# EAGLE design kiev_nrf2401_reva (EAGLE 6.6.0)

## Sheet 1 of 2
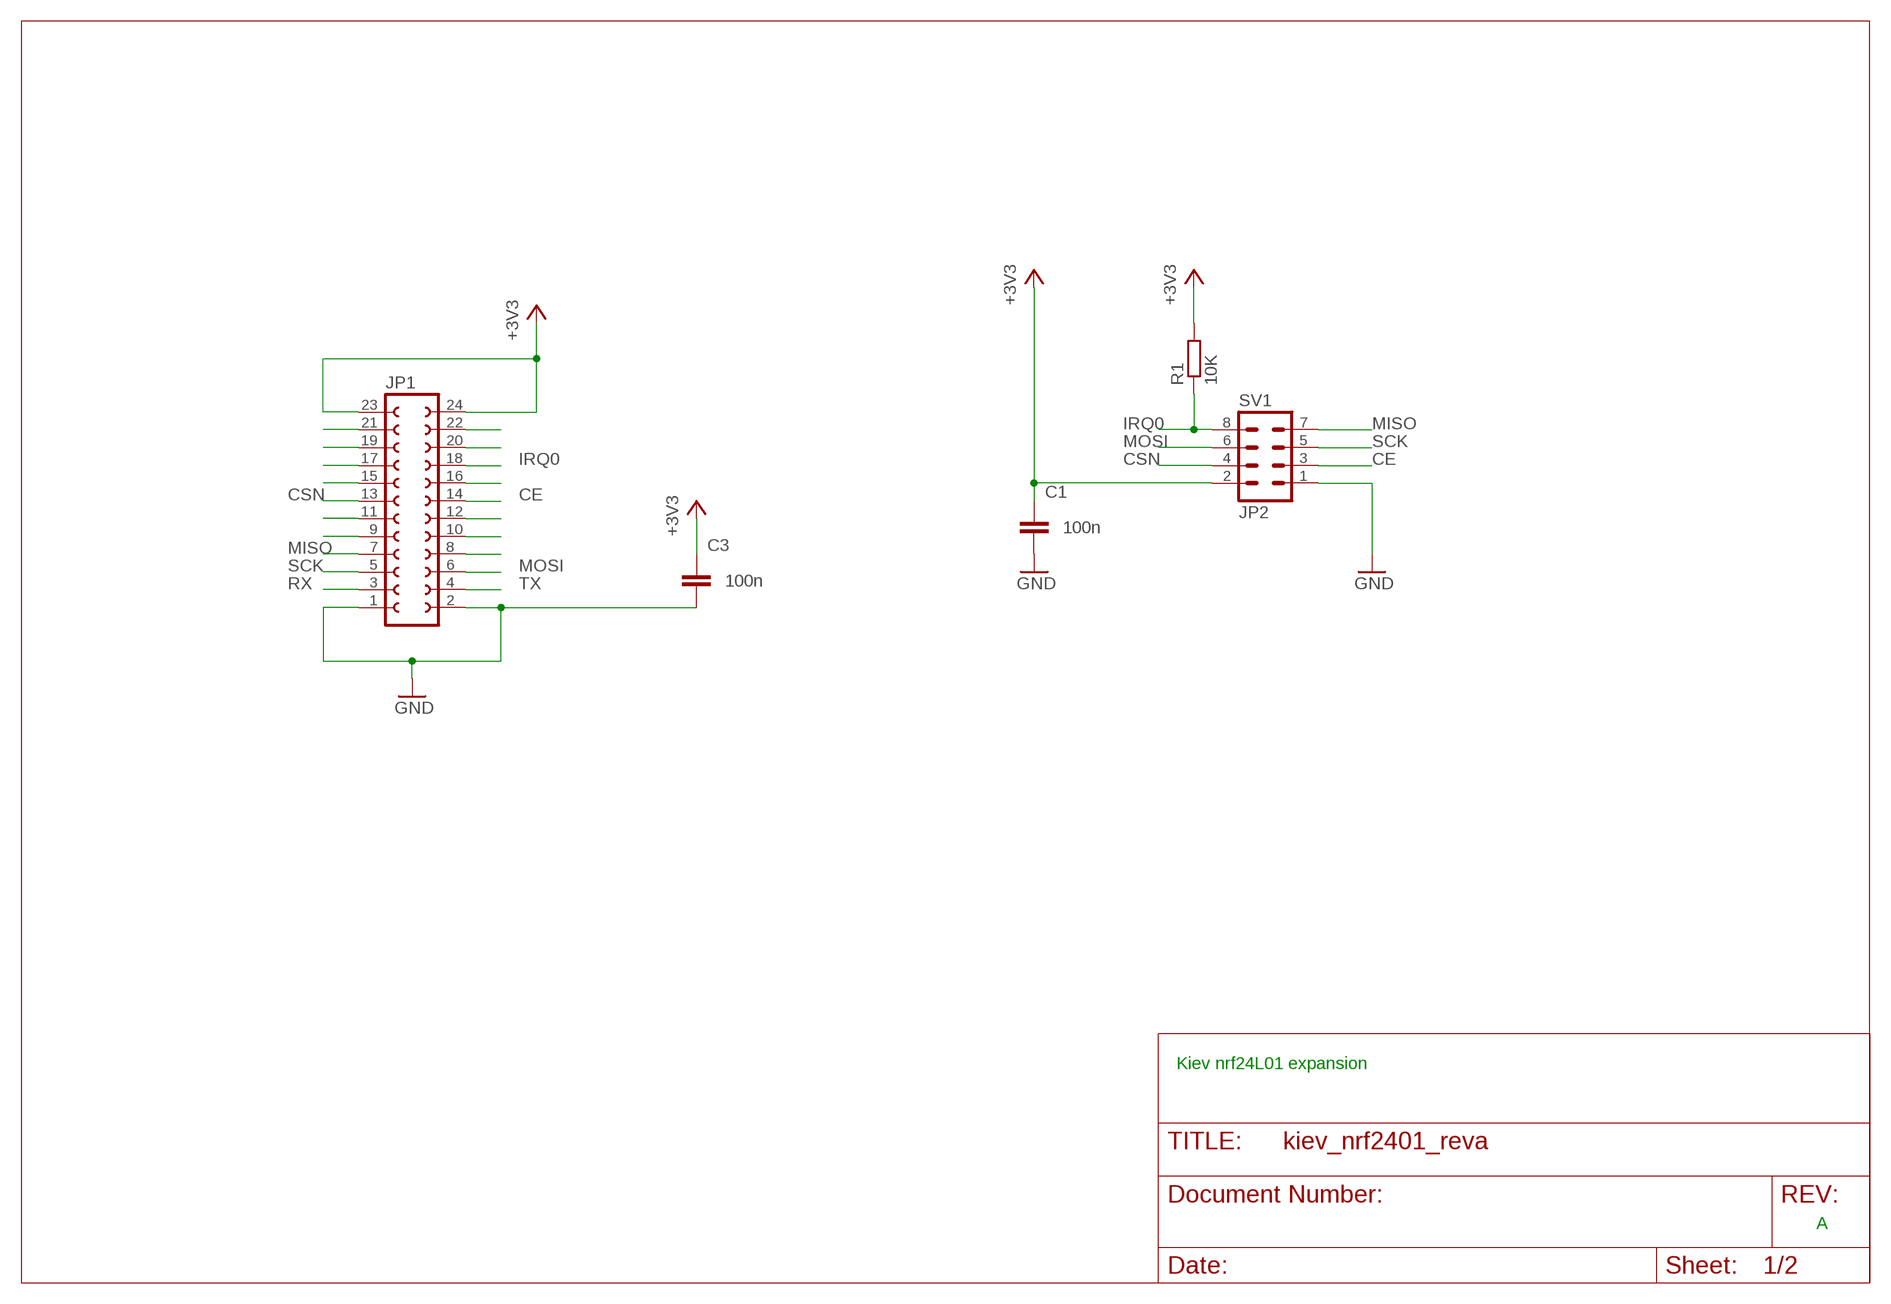
[diagram p0: schematic, sheet 1]

### Parts
C1  100n  C-EUC0805  [C0805]
C3  100n  C-EUC0805  [C0805]
JP1  FE12-2  [FE12-2]
R1  10K  R-EU_R0805  [R0805]
SV1  JP2  MA04-2  [MA04-2]

### Nets
+3V3: C1.1 C3.1 JP1.23 JP1.24 R1.2 SV1.2
CE: JP1.14 SV1.3
CSN: JP1.13 SV1.4
GND: C1.2 C3.2 JP1.1 JP1.2 SV1.1
IRQ0: JP1.18 R1.1 SV1.8
MISO: JP1.7 SV1.7
MOSI: JP1.6 SV1.6
N$9: JP1.22
N$10: JP1.20
N$12: JP1.16
N$14: JP1.12
N$15: JP1.10
N$16: JP1.8
N$21: JP1.21
N$22: JP1.19
N$23: JP1.17
N$24: JP1.15
N$26: JP1.11
N$27: JP1.9
RX: JP1.3
SCK: JP1.5 SV1.5
TX: JP1.4

### Notes on the sheet
- Kiev nrf24L01 expansion
- A

## Sheet 2 of 2
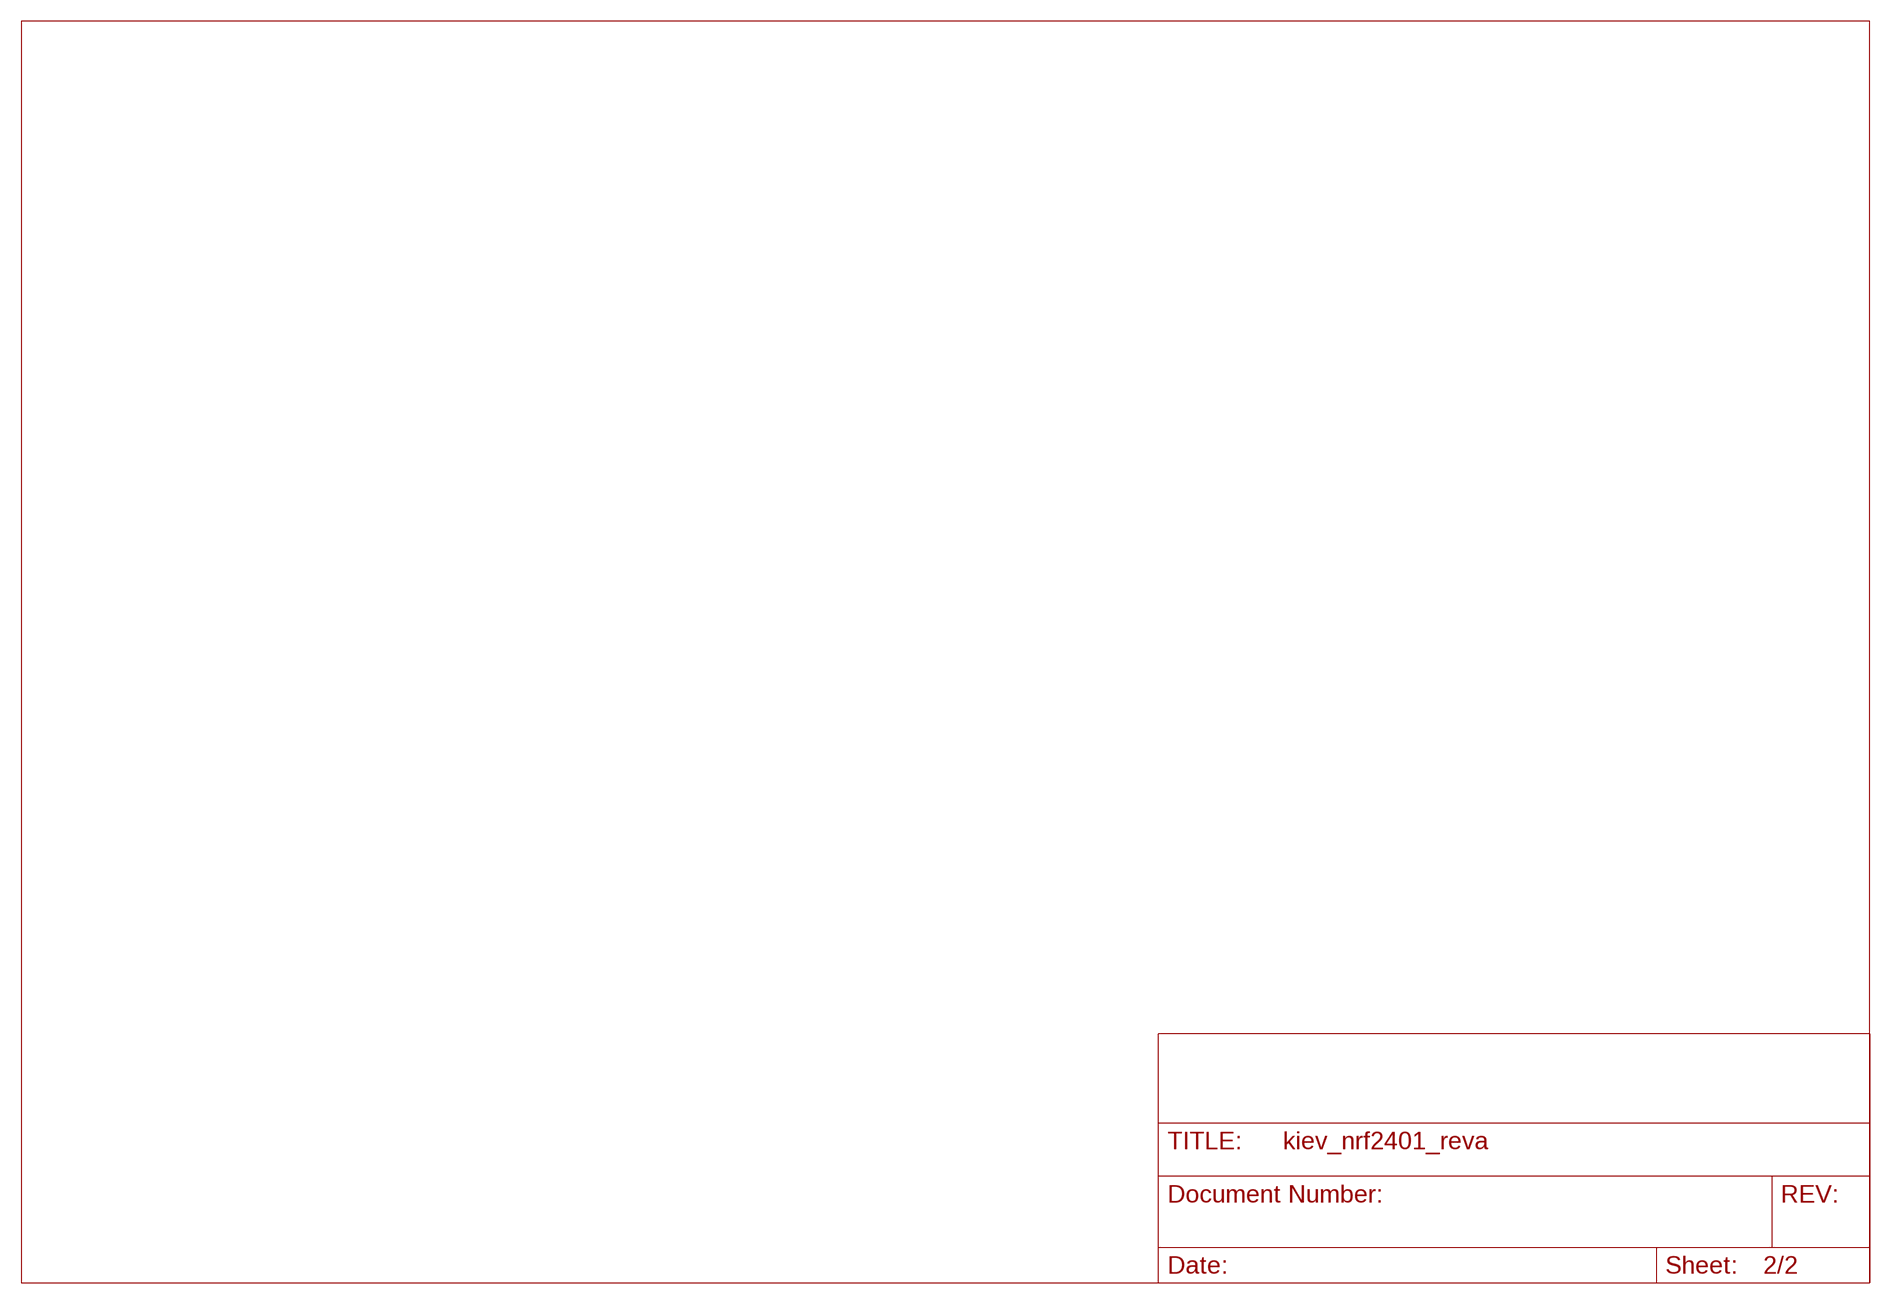
[diagram p1: schematic, sheet 2]

## Library data of the parts
C1 C3 = rcl:C-EU: CAPACITOR, European symbol
JP1 = con-lsta:FE12-2: FEMALE HEADER; OC_FARNELL: unknown; OC_NEWARK: unknown
R1 = rcl:R-EU_: RESISTOR, European symbol
SV1 = con-lstb:MA04-2: PIN HEADER; OC_FARNELL: unknown; OC_NEWARK: unknown

## Board
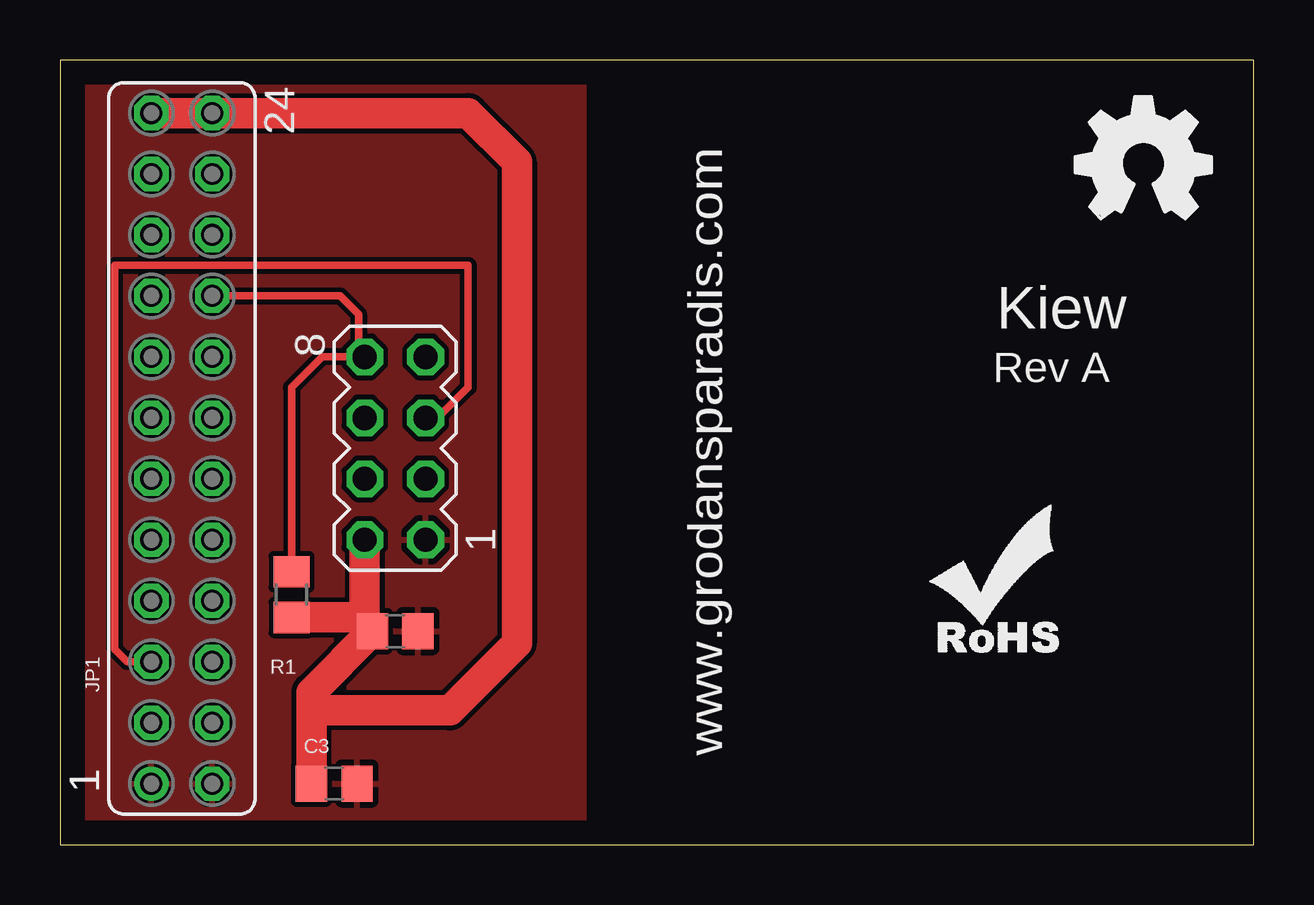
[diagram p2: board, top side]
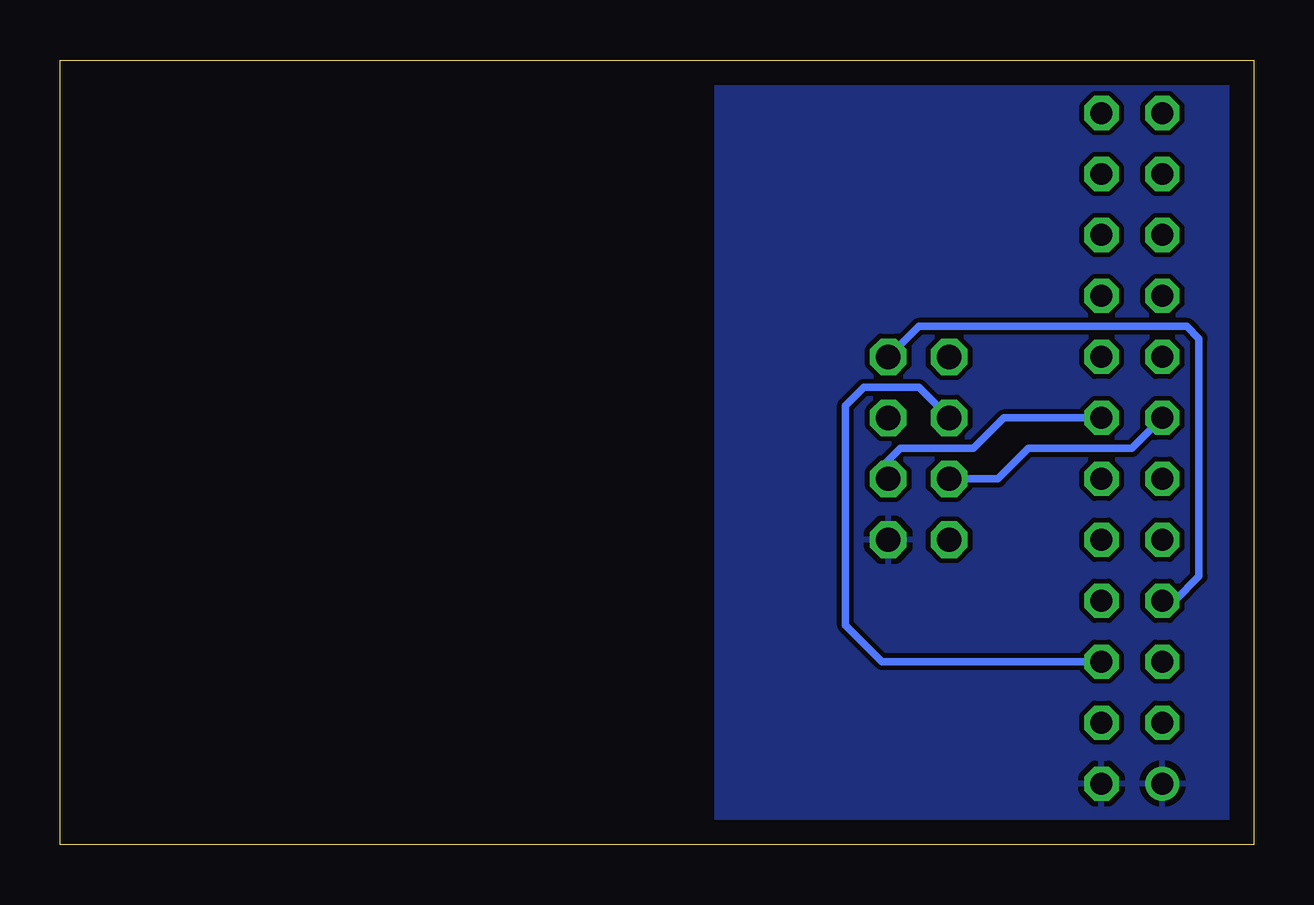
[diagram p3: board, bottom side, seen from below]

Size 49.76 x 32.69 mm. Coordinates in mm from the lower left corner, seen from the top.
Outline: 0,0 49.76,0 49.76,32.69 0,32.69 0,0
Copper layers (1*16): Top 0.035mm / dielectric 1.5mm / Bottom 0.035mm
Design rules "default": minimum track width 10mil, minimum drill 24mil, track to track 8mil, track to pad 8mil, pad to pad 8mil, via to via 8mil, smd to smd 8mil, copper to edge 40mil, drill to drill 8mil, minimum pad ring 10mil, minimum via ring 8mil, stop-mask expansion 4mil, vias tented up to drill 0mil, thermal gap 10mil

### Footprints (pad centres in the part's own frame; a part is rotated, then mirrored left to right if it is on the bottom)
C0805 = smd 1.3 x 1.5: 1 -0.95,0; 2 0.95,0
FE12-2 = drill 0.914: 1 -13.97,1.27 | drill 0.914 octagon: 2 -13.97,-1.27; 3 -11.43,1.27; 4 -11.43,-1.27; 5 -8.89,1.27; 6 -8.89,-1.27; 7 -6.35,1.27; 8 -6.35,-1.27; 9 -3.81,1.27; 10 -3.81,-1.27; 11 -1.27,1.27; 12 -1.27,-1.27; 13 1.27,1.27; 14 1.27,-1.27; 15 3.81,1.27; 16 3.81,-1.27; 17 6.35,1.27; 18 6.35,-1.27; 19 8.89,1.27; 20 8.89,-1.27; 21 11.43,1.27; 22 11.43,-1.27; 23 13.97,1.27; 24 13.97,-1.27
R0805 = smd 1.3 x 1.5: 1 -0.95,0; 2 0.95,0
MA04-2 = drill 1.016 octagon: 1 -3.81,-1.27; 2 -3.81,1.27; 3 -1.27,-1.27; 4 -1.27,1.27; 5 1.27,-1.27; 6 1.27,1.27; 7 3.81,-1.27; 8 3.81,1.27

### Placement (x,y rotation side)
C1  13.97,8.89 0 top
C3  11.43,2.54 0 top
JP1  5.08,16.51 90 top
R1  9.65,10.41 270 top
SV1  13.97,16.51 90 top
U$1  [OSHW_FILLX200_NOTEXT]  42.32,26.08 0 top
U$2  [ROHS_SILK]  38.35,10.41 0 top

### Tracks (layer width: path | path; a pad name or v marks a point on that pad's centre or on a via)
+3V3
  Top 0.254: 12.7,8.89 C1.1 | 12.51,9.46 12.7,9.65
  Top 1.27: C3.1 10.48,5.84 | 10.48,5.84 10.48,6.35 C1.1 | SV1.2 12.7,9.65 12.7,8.89 | R1.2 12.51,9.46 | JP1.24 JP1.23 17.02,30.48 19.05,28.45 19.05,8.38 16.26,5.59 10.73,5.59 10.48,5.84
CE
  Bottom 0.305: JP1.14 10.41,17.78 11.68,16.51 14.73,16.51 15.49,15.75 15.49,15.49 SV1.3
CSN
  Bottom 0.305: SV1.4 10.67,15.24 9.4,16.51 5.08,16.51 JP1.13
GND
  pour Top: 0,33.02 0,0 21.84,0 21.84,33.02
  pour Bottom: 0,33.02 0,0 22.35,0 22.35,33.02
IRQ0
  Top 0.305: JP1.18 11.68,22.86 12.45,22.1 12.45,20.57 SV1.8 10.92,20.32 9.65,19.05 R1.1
MISO
  Bottom 0.305: JP1.7 3.3,10.16 2.29,11.18 2.29,21.08 2.79,21.59 13.97,21.59 SV1.7
MOSI
  Bottom 0.305: JP1.6 15.49,7.62 17.02,9.14 17.02,18.29 16.26,19.05 13.97,19.05 SV1.6
SCK
  Top 0.305: JP1.5 2.79,7.62 2.29,8.13 2.29,24.13 17.02,24.13 17.02,19.05 15.75,17.78 SV1.5

### Text on the board
tNames: www.grodansparadis.com | Kiew | Rev A